# Altium schematic sheet EL_LCD_V2.0.SchDoc
size A1
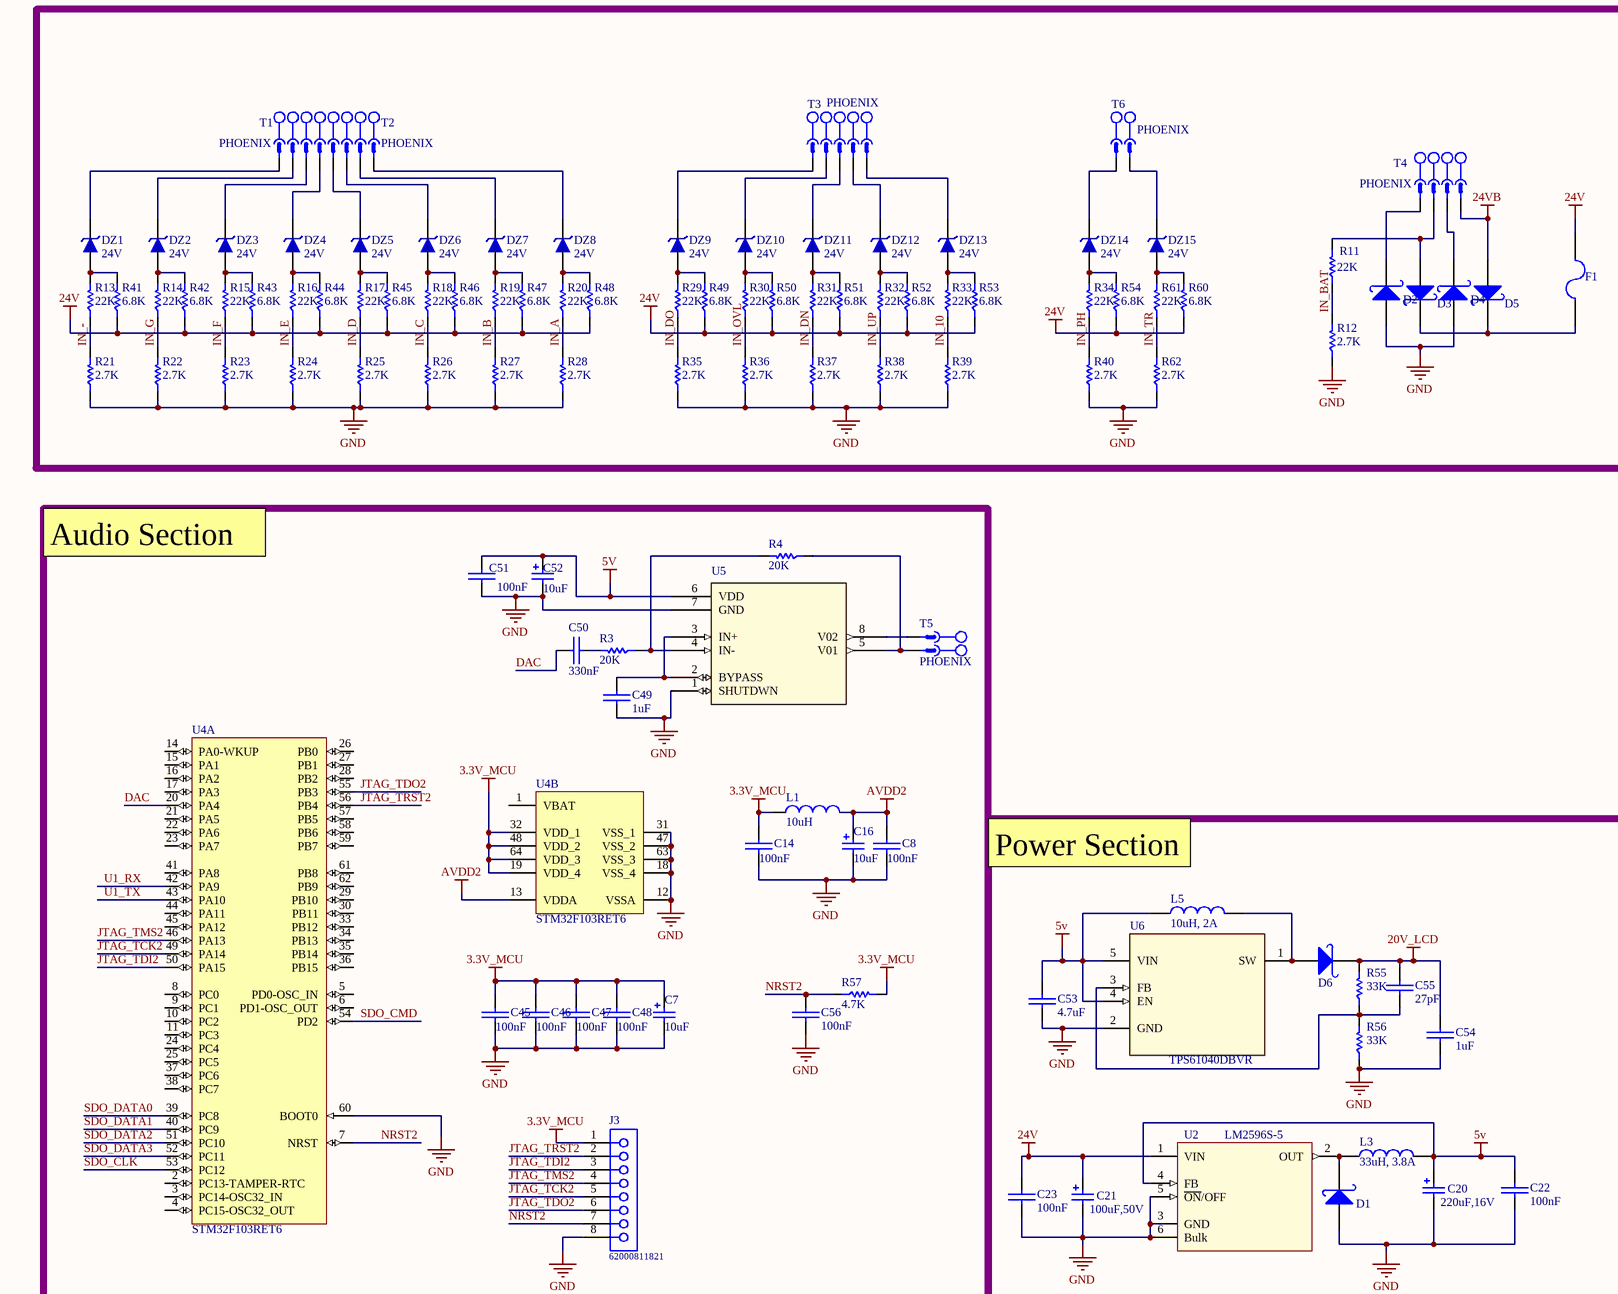
[diagram p0: EL_LCD_V2.0.SchDoc, top left]
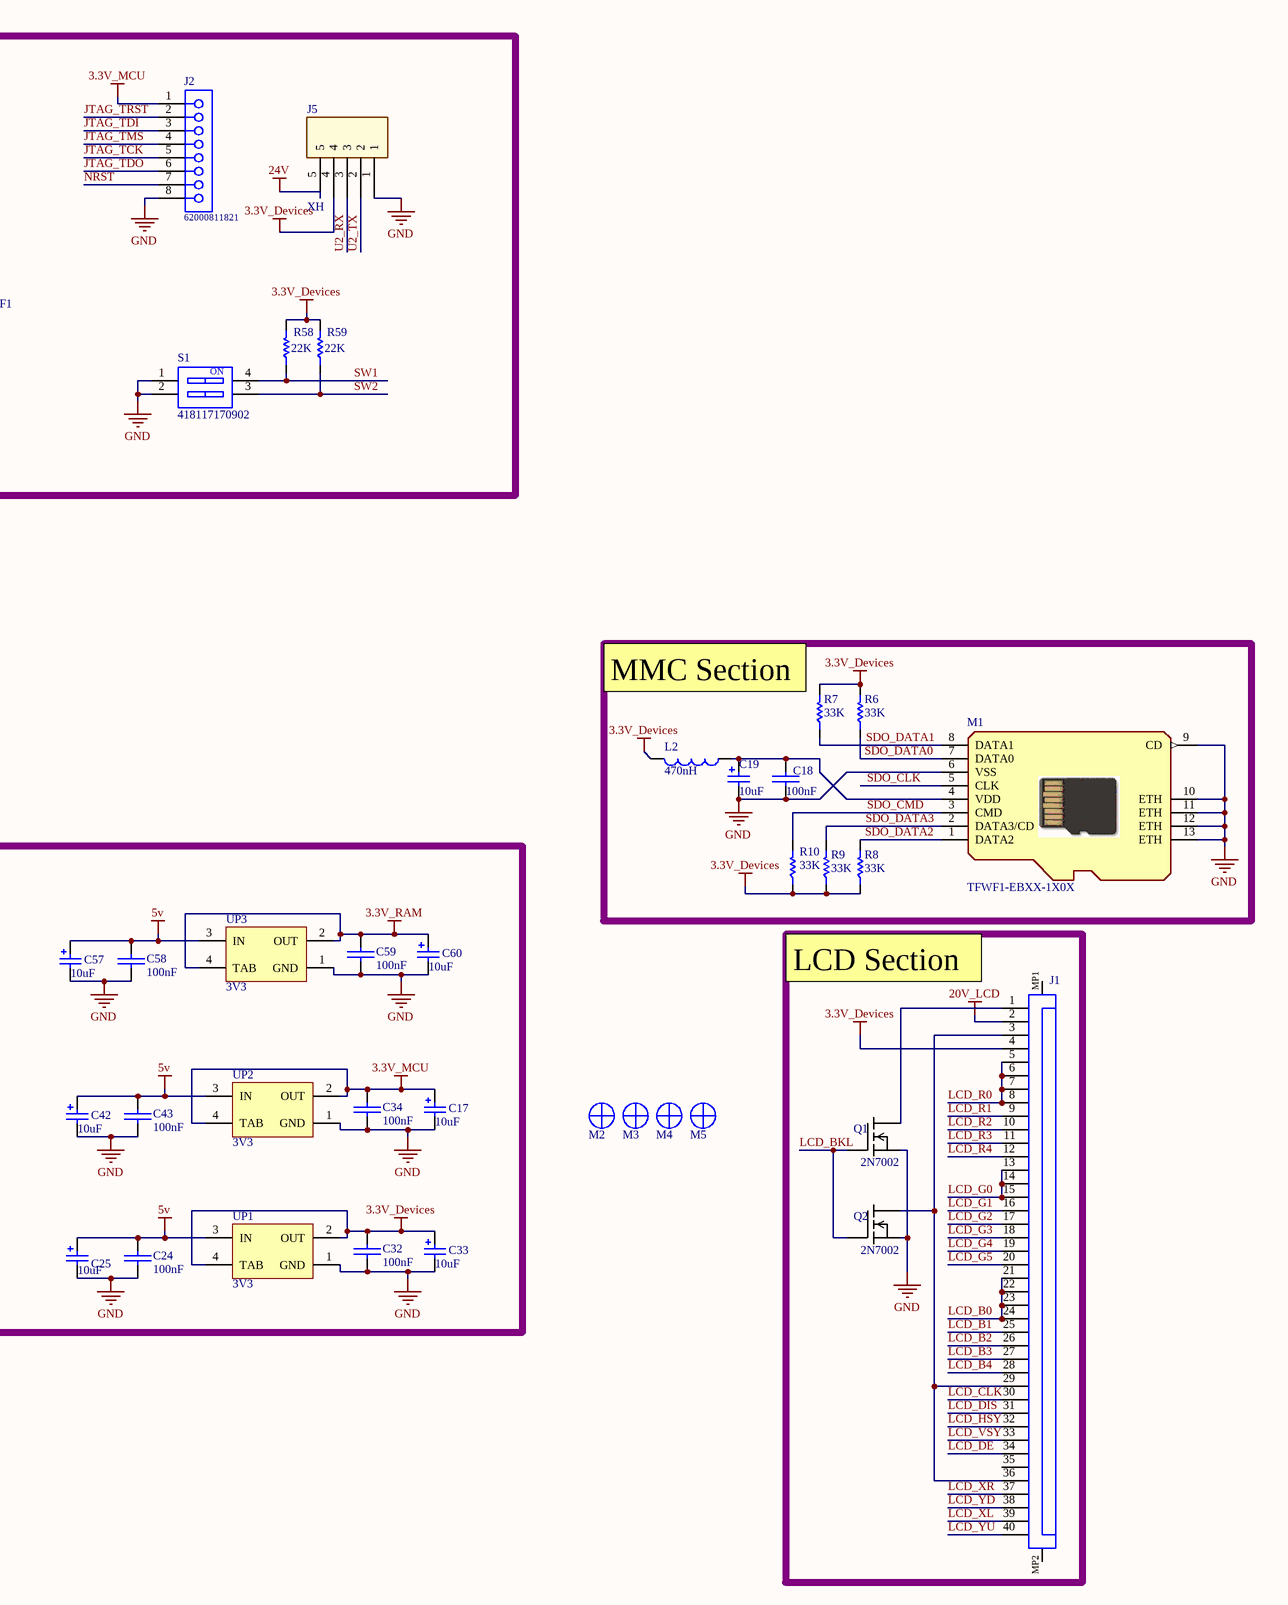
[diagram p1: EL_LCD_V2.0.SchDoc, top right]
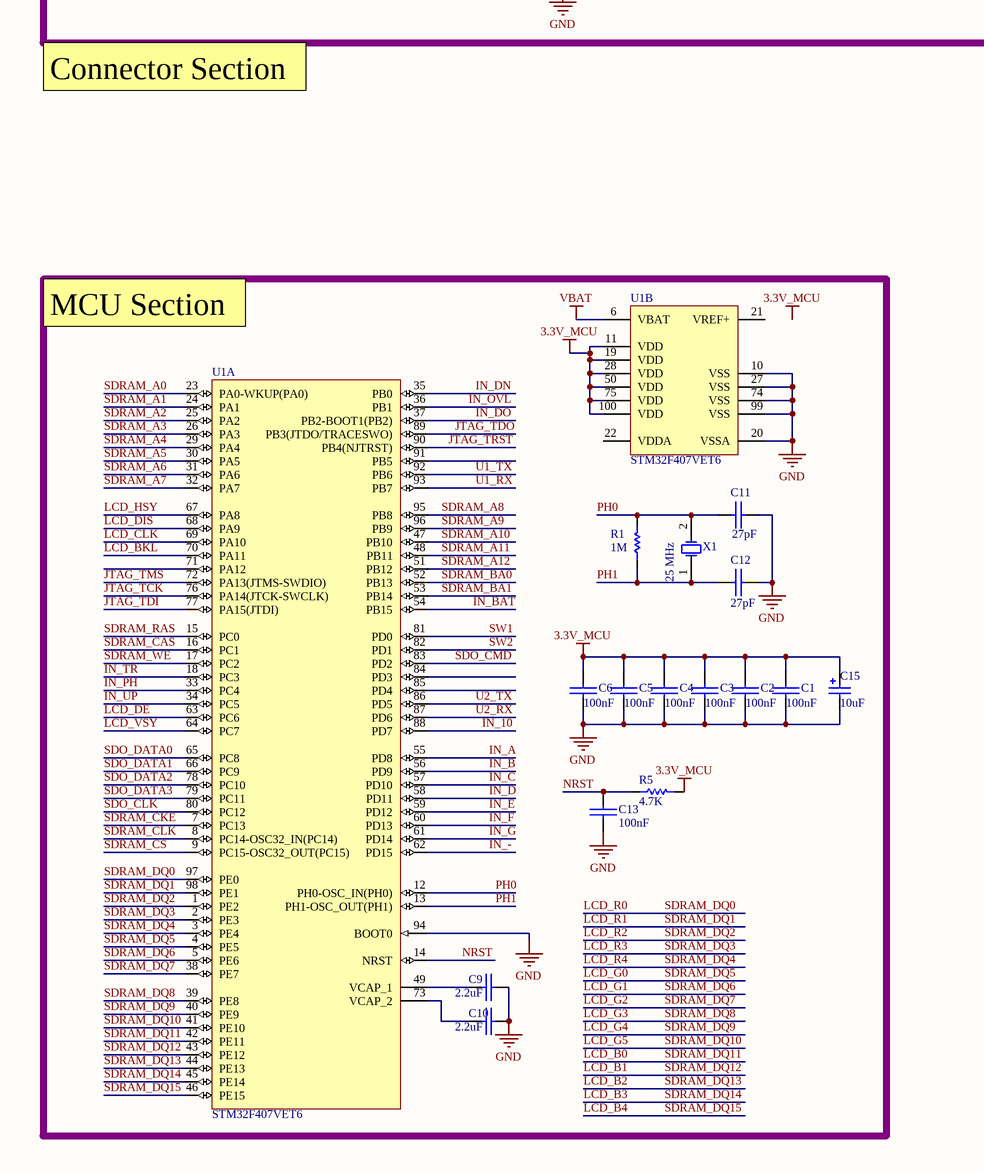
[diagram p2: EL_LCD_V2.0.SchDoc, bottom left]
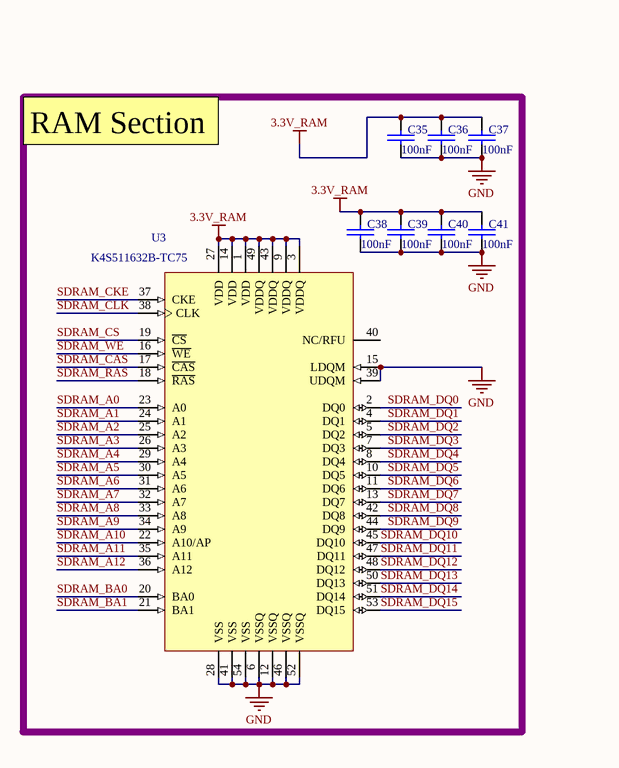
[diagram p3: EL_LCD_V2.0.SchDoc, bottom right]

## Parts
C1  100nF  [SMD_CAP_0805]
C2  100nF  [SMD_CAP_0805]
C3  100nF  [SMD_CAP_0805]
C4  100nF  [SMD_CAP_0805]
C5  100nF  [SMD_CAP_0805]
C6  100nF  [SMD_CAP_0805]
C7  10uF  [WCAP-AS5H_4x5.5]
C8  100nF  [SMD_CAP_0805]
C9  2.2uF  [SMD_CAP_1206]
C10  2.2uF  [SMD_CAP_1206]
C11  27pF  [SMD_CAP_0805]
C12  27pF  [SMD_CAP_0805]
C13  100nF  [SMD_CAP_0805]
C14  100nF  [SMD_CAP_0805]
C15  10uF  [WCAP-AS5H_4x5.5]
C16  10uF  [WCAP-AS5H_4x5.5]
C17  10uF  [WCAP-AS5H_4x5.5]
C18  100nF  [SMD_CAP_0805]
C19  10uF  [WCAP-AS5H_4x5.5]
C20  220uF,16V  [WCAP-AS5H_6.3x7.7]
C21  100uF,50V  [WCAP-AS5H_8x10.5]
C22  100nF  [SMD_CAP_0805]
C23  100nF  [SMD_CAP_0805]
C24  100nF  [SMD_CAP_0805]
C25  10uF  [WCAP-AS5H_4x5.5]
C32  100nF  [SMD_CAP_0805]
C33  10uF  [WCAP-AS5H_4x5.5]
C34  100nF  [SMD_CAP_0805]
C35  100nF  [SMD_CAP_0805]
C36  100nF  [SMD_CAP_0805]
C37  100nF  [SMD_CAP_0805]
C38  100nF  [SMD_CAP_0805]
C39  100nF  [SMD_CAP_0805]
C40  100nF  [SMD_CAP_0805]
C41  100nF  [SMD_CAP_0805]
C42  10uF  [WCAP-AS5H_4x5.5]
C43  100nF  [SMD_CAP_0805]
C45  100nF  [SMD_CAP_0805]
C46  100nF  [SMD_CAP_0805]
C47  100nF  [SMD_CAP_0805]
C48  100nF  [SMD_CAP_0805]
C49  1uF  [SMD_CAP_0805]
C50  330nF  [SMD_CAP_0805]
C51  100nF  [SMD_CAP_0805]
C52  10uF  [WCAP-AS5H_4x5.5]
C53  4.7uF  [SMD_CAP_0805]
C54  1uF  [SMD_CAP_1206]
C55  27pF  [SMD_CAP_0805]
C56  100nF  [SMD_CAP_0805]
C57  10uF  [WCAP-AS5H_4x5.5]
C58  100nF  [SMD_CAP_0805]
C59  100nF  [SMD_CAP_0805]
C60  10uF  [WCAP-AS5H_4x5.5]
D1  1n5822  [Diode 1N4007 SMD]  (value not drawn)
D2  1n5822  [Diode 1N4007 SMD]  (value not drawn)
D3  1n5822  [Diode 1N4007 SMD]  (value not drawn)
D4  1n5822  [Diode 1N4007 SMD]  (value not drawn)
D5  1n5822  [Diode 1N4007 SMD]  (value not drawn)
D6  1n5822  [Diode 1N4007 SMD]  (value not drawn)
DZ1  24V  [SOD80, LL-34]
DZ2  24V  [SOD80, LL-34]
DZ3  24V  [SOD80, LL-34]
DZ4  24V  [SOD80, LL-34]
DZ5  24V  [SOD80, LL-34]
DZ6  24V  [SOD80, LL-34]
DZ7  24V  [SOD80, LL-34]
DZ8  24V  [SOD80, LL-34]
DZ9  24V  [SOD80, LL-34]
DZ10  24V  [SOD80, LL-34]
DZ11  24V  [SOD80, LL-34]
DZ12  24V  [SOD80, LL-34]
DZ13  24V  [SOD80, LL-34]
DZ14  24V  [SOD80, LL-34]
DZ15  24V  [SOD80, LL-34]
F1  F=1.0 A  [1206 FUSE]  (value not drawn)
J1  (no value)  [687140149022]
J2  62000811821  [62000811821]
J3  62000811821  [62000811821]
J5  XH  [XH-12-Right]
L1  10uH  [IND1206]
L2  470nH  [IND1206]
L3  33uH, 3.8A  [WE-PD_1210]
L5  10uH, 2A  [WE-PD_7345]
M1  TFWF1-EBXX-1X0X  [TFWF1-EBXX-1X0X]
M2  Screw  [Board Screw]  (value not drawn)
M3  Screw  [Board Screw]  (value not drawn)
M4  Screw  [Board Screw]  (value not drawn)
M5  Screw  [Board Screw]  (value not drawn)
Q1  2N7002  [*SOT23]
Q2  2N7002  [*SOT23]
R1  1M  [RES 0805 (2012X06L)]
R3  20K  [RES 0805 (2012X06L)]
R4  20K  [RES 0805 (2012X06L)]
R5  4.7K  [RES 0805 (2012X06L)]
R6  33K  [RES 0805 (2012X06L)]
R7  33K  [RES 0805 (2012X06L)]
R8  33K  [RES 0805 (2012X06L)]
R9  33K  [RES 0805 (2012X06L)]
R10  33K  [RES 0805 (2012X06L)]
R11  22K  [RES 0805 (2012X06L)]
R12  2.7K  [RES 0805 (2012X06L)]
R13  22K  [RES 0805 (2012X06L)]
R14  22K  [RES 0805 (2012X06L)]
R15  22K  [RES 0805 (2012X06L)]
R16  22K  [RES 0805 (2012X06L)]
R17  22K  [RES 0805 (2012X06L)]
R18  22K  [RES 0805 (2012X06L)]
R19  22K  [RES 0805 (2012X06L)]
R20  22K  [RES 0805 (2012X06L)]
R21  2.7K  [RES 0805 (2012X06L)]
R22  2.7K  [RES 0805 (2012X06L)]
R23  2.7K  [RES 0805 (2012X06L)]
R24  2.7K  [RES 0805 (2012X06L)]
R25  2.7K  [RES 0805 (2012X06L)]
R26  2.7K  [RES 0805 (2012X06L)]
R27  2.7K  [RES 0805 (2012X06L)]
R28  2.7K  [RES 0805 (2012X06L)]
R29  22K  [RES 0805 (2012X06L)]
R30  22K  [RES 0805 (2012X06L)]
R31  22K  [RES 0805 (2012X06L)]
R32  22K  [RES 0805 (2012X06L)]
R33  22K  [RES 0805 (2012X06L)]
R34  22K  [RES 0805 (2012X06L)]
R35  2.7K  [RES 0805 (2012X06L)]
R36  2.7K  [RES 0805 (2012X06L)]
R37  2.7K  [RES 0805 (2012X06L)]
R38  2.7K  [RES 0805 (2012X06L)]
R39  2.7K  [RES 0805 (2012X06L)]
R40  2.7K  [RES 0805 (2012X06L)]
R41  6.8K  [RES 0805 (2012X06L)]
R42  6.8K  [RES 0805 (2012X06L)]
R43  6.8K  [RES 0805 (2012X06L)]
R44  6.8K  [RES 0805 (2012X06L)]
R45  6.8K  [RES 0805 (2012X06L)]
R46  6.8K  [RES 0805 (2012X06L)]
R47  6.8K  [RES 0805 (2012X06L)]
R48  6.8K  [RES 0805 (2012X06L)]
R49  6.8K  [RES 0805 (2012X06L)]
R50  6.8K  [RES 0805 (2012X06L)]
R51  6.8K  [RES 0805 (2012X06L)]
R52  6.8K  [RES 0805 (2012X06L)]
R53  6.8K  [RES 0805 (2012X06L)]
R54  6.8K  [RES 0805 (2012X06L)]
R55  33K  [RES 0805 (2012X06L)]
R56  33K  [RES 0805 (2012X06L)]
R57  4.7K  [RES 0805 (2012X06L)]
R58  22K  [RES 0805 (2012X06L)]
R59  22K  [RES 0805 (2012X06L)]
R60  6.8K  [RES 0805 (2012X06L)]
R61  22K  [RES 0805 (2012X06L)]
R62  2.7K  [RES 0805 (2012X06L)]
S1  418117170902  [418117170902]
T1  PHOENIX  [MSTB 2,5/4-G-5,08]
T2  PHOENIX  [MSTB 2,5/4-G-5,08]
T3  PHOENIX  [MSTB 2,5/5-G-5,08]
T4  PHOENIX  [MSTB 2,5/4-G-5,08]
T5  PHOENIX  [MSTB 2,5/2-G-5,08]
T6  PHOENIX  [MSTB 2,5/2-G-5,08]
U1  STM32F407VET6  [STM-LQFP100_N]  (parts A,B of 2)
U2  LM2596S-5  [*TO170P1435X465-6N]
U3  K4S511632B-TC75  [54_TSOP2_400AF_N]
U4  STM32F103RET6  [STM-LQFP64_N]  (parts A,B of 2)
U5  LM4871  [*SO08]  (value not drawn)
U6  TPS61040DBVR  [*SOT95P280X145-5N]
UP1  3V3  [SOT223]
UP2  3V3  [SOT223]
UP3  3V3  [SOT223]
X1  25 MHz  [Crystal SMD]

## Nets
3.3V_Devices: C32.1(+) C33.2(P) J1.4 J5.4 L2.2 R6.2 R7.2 R8.1 R9.1 R10.1 R58.2 R59.2 UP1.2(OUT) UP1.4(TAB)
3.3V_MCU: C1.1(+) C2.1(+) C3.1(+) C4.1(+) C5.1(+) C6.1(+) C7.2(P) C14.1(+) C15.2(P) C17.2(P) C34.1(+) C45.1(+) C46.1(+) C47.1(+) C48.1(+) J2.1 J3.1 L1.1 R5.2 R57.2 U1.11(VDD) U1.19(VDD) U1.28(VDD) U1.50(VDD) U1.75(VDD) U1.100(VDD) U4.19(VDD_4) U4.32(VDD_1) U4.48(VDD_2) U4.64(VDD_3) UP2.2(OUT) UP2.4(TAB)
3.3V_RAM: C35.1(+) C36.1(+) C37.1(+) C38.1(+) C39.1(+) C40.1(+) C41.1(+) C59.1(+) C60.2(P) U3.1(VDD) U3.3(VDDQ) U3.9(VDDQ) U3.14(VDD) U3.27(VDD) U3.43(VDDQ) U3.49(VDDQ) UP3.2(OUT) UP3.4(TAB)
5v: C20.2(P) C22.1(+) C24.1(+) C25.2(P) C42.2(P) C43.1(+) C51.1(+) C52.2(P) C53.1(+) C57.2(P) C58.1(+) L3.2 L5.1 U2.4(FB) U5.6(VDD) U6.4(EN) U6.5(VIN) UP1.3(IN) UP2.3(IN) UP3.3(IN)
20V_LCD: C54.1(+) C55.2(-) D6.2(K) J1.2 R55.2
24V: C21.2(P) C23.1(+) F1.2 J5.5 R41.1 R42.1 R43.1 R44.1 R45.1 R46.1 R47.1 R48.1 R49.1 R50.1 R51.1 R52.1 R53.1 R54.1 R60.1 U2.1(VIN)
24VB: D5.1(A) T4.4
AVDD2: C8.1(+) C16.2(P) L1.2 U4.13(VDDA)
GND: C1.2(-) C2.2(-) C3.2(-) C4.2(-) C5.2(-) C6.2(-) C7.1(N) C8.2(-) C9.2(-) C10.2(-) C11.2(-) C12.2(-) C13.2(-) C14.2(-) C15.1(N) C16.1(N) C17.1(N) C18.2(-) C19.1(N) C20.1(N) C21.1(N) C22.2(-) C23.2(-) C24.2(-) C25.1(N) C32.2(-) C33.1(N) C34.2(-) C35.2(-) C36.2(-) C37.2(-) C38.2(-) C39.2(-) C40.2(-) C41.2(-) C42.1(N) C43.2(-) C45.2(-) C46.2(-) C47.2(-) C48.2(-) C49.2(-) C51.2(-) C52.1(N) C53.2(-) C54.2(-) C56.2(-) C57.1(N) C58.2(-) C59.2(-) C60.1(N) D1.1(A) D2.1(A) D4.1(A) J2.8 J3.8 J5.1 M1.6(VSS) M1.9(CD) M1.10(ETH) M1.11(ETH) M1.12(ETH) M1.13(ETH) Q1.2(S) Q2.2(S) R12.1 R21.1 R22.1 R23.1 R24.1 R25.1 R26.1 R27.1 R28.1 R35.1 R36.1 R37.1 R38.1 R39.1 R40.1 R56.1 R62.1 S1.1 S1.2 U1.10(VSS) U1.20(VSSA) U1.27(VSS) U1.74(VSS) U1.94(BOOT0) U1.99(VSS) U2.3(GND) U2.5(~{ON}/OFF) U2.6(Bulk) U3.6(VSSQ) U3.12(VSSQ) U3.15(LDQM) U3.28(VSS) U3.39(UDQM) U3.41(VSS) U3.46(VSSQ) U3.52(VSSQ) U3.54(VSS) U4.12(VSSA) U4.18(VSS_4) U4.31(VSS_1) U4.47(VSS_2) U4.60(BOOT0) U4.63(VSS_3) U5.1(SHUTDWN) U5.7(GND) U6.2(GND) UP1.1(GND) UP2.1(GND) UP3.1(GND)
VBAT: U1.6(VBAT)
DAC: C50.1(+) U4.20(PA4)
IN_10: R33.1 R39.2 U1.88(PD7)
IN_-: R13.1 R21.2 U1.62(PD15)
IN_A: R20.1 R28.2 U1.55(PD8)
IN_B: R19.1 R27.2 U1.56(PD9)
IN_BAT: R11.1 R12.2 U1.54(PB15)
IN_C: R18.1 R26.2 U1.57(PD10)
IN_D: R17.1 R25.2 U1.58(PD11)
IN_DN: R31.1 R37.2 U1.35(PB0)
IN_DO: R29.1 R35.2 U1.37(PB2-BOOT1(PB2))
IN_E: R16.1 R24.2 U1.59(PD12)
IN_F: R15.1 R23.2 U1.60(PD13)
IN_G: R14.1 R22.2 U1.61(PD14)
IN_OVL: R30.1 R36.2 U1.36(PB1)
IN_PH: R34.1 R40.2 U1.33(PC4)
IN_TR: R61.1 R62.2 U1.18(PC3)
IN_UP: R32.1 R38.2 U1.34(PC5)
JTAG_TCK: J2.5 U1.76(PA14(JTCK-SWCLK))
JTAG_TCK2: J3.5 U4.49(PA14)
JTAG_TDI: J2.3 U1.77(PA15(JTDI))
JTAG_TDI2: J3.3 U4.50(PA15)
JTAG_TDO: J2.6 U1.89(PB3(JTDO/TRACESWO))
JTAG_TDO2: J3.6 U4.55(PB3)
JTAG_TMS: J2.4 U1.72(PA13(JTMS-SWDIO))
JTAG_TMS2: J3.4 U4.46(PA13)
JTAG_TRST: J2.2 U1.90(PB4(NJTRST))
JTAG_TRST2: J3.2 U4.56(PB4)
LCD_B0: J1.21 J1.22 J1.23 J1.24 U1.42(PE11) U3.47(DQ11)  [also labelled SDRAM_DQ11]
LCD_B1: J1.25 U1.43(PE12) U3.48(DQ12)  [also labelled SDRAM_DQ12]
LCD_B2: J1.26 U1.44(PE13) U3.50(DQ13)  [also labelled SDRAM_DQ13]
LCD_B3: J1.27 U1.45(PE14) U3.51(DQ14)  [also labelled SDRAM_DQ14]
LCD_B4: J1.28 U1.46(PE15) U3.53(DQ15)  [also labelled SDRAM_DQ15]
LCD_BKL: Q1.1(G) Q2.1(G) U1.70(PA11)
LCD_CLK: J1.30 U1.69(PA10)
LCD_DE: J1.34 U1.63(PC6)
LCD_DIS: J1.31 U1.68(PA9)
LCD_G0: J1.13 J1.14 J1.15 U1.4(PE5) U3.10(DQ5)  [also labelled SDRAM_DQ5]
LCD_G1: J1.16 U1.5(PE6) U3.11(DQ6)  [also labelled SDRAM_DQ6]
LCD_G2: J1.17 U1.38(PE7) U3.13(DQ7)  [also labelled SDRAM_DQ7]
LCD_G3: J1.18 U1.39(PE8) U3.42(DQ8)  [also labelled SDRAM_DQ8]
LCD_G4: J1.19 U1.40(PE9) U3.44(DQ9)  [also labelled SDRAM_DQ9]
LCD_G5: J1.20 U1.41(PE10) U3.45(DQ10)  [also labelled SDRAM_DQ10]
LCD_HSY: J1.32 U1.67(PA8)
LCD_R0: J1.5 J1.6 J1.7 J1.8 U1.97(PE0) U3.2(DQ0)  [also labelled SDRAM_DQ0]
LCD_R1: J1.9 U1.98(PE1) U3.4(DQ1)  [also labelled SDRAM_DQ1]
LCD_R2: J1.10 U1.1(PE2) U3.5(DQ2)  [also labelled SDRAM_DQ2]
LCD_R3: J1.11 U1.2(PE3) U3.7(DQ3)  [also labelled SDRAM_DQ3]
LCD_R4: J1.12 U1.3(PE4) U3.8(DQ4)  [also labelled SDRAM_DQ4]
LCD_VSY: J1.33 U1.64(PC7)
LCD_XL: J1.39
LCD_XR: J1.37
LCD_YD: J1.38
LCD_YU: J1.40
NRST: C13.1(+) J2.7 R5.1 U1.14(NRST)
NRST2: C56.1(+) J3.7 R57.1 U4.7(NRST)
PH0: C11.1(+) R1.2 U1.12(PH0-OSC_IN(PH0)) X1.2(OSC2)
PH1: C12.1(+) R1.1 U1.13(PH1-OSC_OUT(PH1)) X1.1(OSC1)
SDO_CLK: M1.5(CLK) U1.80(PC12) U4.53(PC12)
SDO_CMD: M1.3(CMD) R10.2 U1.83(PD2) U4.54(PD2)
SDO_DATA0: M1.7(DATA0) R6.1 U1.65(PC8) U4.39(PC8)
SDO_DATA1: M1.8(DATA1) R7.1 U1.66(PC9) U4.40(PC9)
SDO_DATA2: M1.1(DATA2) R8.2 U1.78(PC10) U4.51(PC10)
SDO_DATA3: M1.2(DATA3/CD) R9.2 U1.79(PC11) U4.52(PC11)
SDRAM_A0: U1.23(PA0-WKUP(PA0)) U3.23(A0)
SDRAM_A1: U1.24(PA1) U3.24(A1)
SDRAM_A2: U1.25(PA2) U3.25(A2)
SDRAM_A3: U1.26(PA3) U3.26(A3)
SDRAM_A4: U1.29(PA4) U3.29(A4)
SDRAM_A5: U1.30(PA5) U3.30(A5)
SDRAM_A6: U1.31(PA6) U3.31(A6)
SDRAM_A7: U1.32(PA7) U3.32(A7)
SDRAM_A8: U1.95(PB8) U3.33(A8)
SDRAM_A9: U1.96(PB9) U3.34(A9)
SDRAM_A10: U1.47(PB10) U3.22(A10/AP)
SDRAM_A11: U1.48(PB11) U3.35(A11)
SDRAM_A12: U1.51(PB12) U3.36(A12)
SDRAM_BA0: U1.52(PB13) U3.20(BA0)
SDRAM_BA1: U1.53(PB14) U3.21(BA1)
SDRAM_CAS: U1.16(PC1) U3.17(~{CAS})
SDRAM_CKE: U1.7(PC13) U3.37(CKE)
SDRAM_CLK: U1.8(PC14-OSC32_IN(PC14)) U3.38(CLK)
SDRAM_CS: U1.9(PC15-OSC32_OUT(PC15)) U3.19(~{CS})
SDRAM_RAS: U1.15(PC0) U3.18(~{RAS})
SDRAM_WE: U1.17(PC2) U3.16(~{WE})
SW1: R58.1 S1.4 U1.81(PD0)
SW2: R59.1 S1.3 U1.82(PD1)
U1_RX: U1.93(PB7) U4.42(PA9)
U1_TX: U1.92(PB6) U4.43(PA10)
U2_RX: J5.3 U1.87(PD6)
U2_TX: J5.2 U1.86(PD5)
NetC9_1: C9.1(+) U1.49(VCAP_1)
NetC10_1: C10.1(+) U1.73(VCAP_2)
NetC18_1: C18.1(+) C19.2(P) L2.1 M1.4(VDD)
NetC49_1: C49.1(+) U5.2(BYPASS) U5.3(IN+)
NetC50_2: C50.2(-) R3.2
NetC55_1: C55.1(+) R55.1 R56.2 U6.3(FB)
NetD1_2: D1.2(K) L3.1 U2.2(OUT)
NetD2_2: D2.2(K) T4.1
NetD3_1: D3.1(A) R11.2 T4.2
NetD3_2: D3.2(K) D5.2(K) F1.1
NetD4_2: D4.2(K) T4.3
NetD6_1: D6.1(A) L5.2 U6.1(SW)
NetDZ1_1: DZ1.1 R13.2 R41.2
NetDZ1_2: DZ1.2 T1.1
NetDZ2_1: DZ2.1 R14.2 R42.2
NetDZ2_2: DZ2.2 T1.2
NetDZ3_1: DZ3.1 R15.2 R43.2
NetDZ3_2: DZ3.2 T1.3
NetDZ4_1: DZ4.1 R16.2 R44.2
NetDZ4_2: DZ4.2 T1.4
NetDZ5_1: DZ5.1 R17.2 R45.2
NetDZ5_2: DZ5.2 T2.1
NetDZ6_1: DZ6.1 R18.2 R46.2
NetDZ6_2: DZ6.2 T2.2
NetDZ7_1: DZ7.1 R19.2 R47.2
NetDZ7_2: DZ7.2 T2.3
NetDZ8_1: DZ8.1 R20.2 R48.2
NetDZ8_2: DZ8.2 T2.4
NetDZ9_1: DZ9.1 R29.2 R49.2
NetDZ9_2: DZ9.2 T3.1
NetDZ10_1: DZ10.1 R30.2 R50.2
NetDZ10_2: DZ10.2 T3.2
NetDZ11_1: DZ11.1 R31.2 R51.2
NetDZ11_2: DZ11.2 T3.3
NetDZ12_1: DZ12.1 R32.2 R52.2
NetDZ12_2: DZ12.2 T3.4
NetDZ13_1: DZ13.1 R33.2 R53.2
NetDZ13_2: DZ13.2 T3.5
NetDZ14_1: DZ14.1 R34.2 R54.2
NetDZ14_2: DZ14.2 T6.1
NetDZ15_1: DZ15.1 R60.2 R61.2
NetDZ15_2: DZ15.2 T6.2
NetJ1_1: J1.1 Q1.3(D)
NetJ1_3: J1.3 J1.29 J1.36 Q2.3(D)
NetR3_1: R3.1 R4.2 U5.4(IN-)
NetR4_1: R4.1 T5.2 U5.5(V01)
NetT5_1: T5.1 U5.8(V02)

Not connected (* = marked no-connect by the designer): J1 35 MP1 MP2; U1 21(VREF+) 22(VDDA) 71(PA12) 84(PD3) 85(PD4) 91(PB5); U3 40(NC/RFU); U4 1(VBAT) 2(PC13-TAMPER-RTC) 3(PC14-OSC32_IN) 4(PC15-OSC32_OUT) 5(PD0-OSC_IN) 6(PD1-OSC_OUT) 8(PC0) 9(PC1) 10(PC2) 11(PC3) 14(PA0-WKUP) 15(PA1) 16(PA2) 17(PA3) 21(PA5) 22(PA6) 23(PA7) 24(PC4) 25(PC5) 26(PB0) 27(PB1) 28(PB2) 29(PB10) 30(PB11) 33(PB12) 34(PB13) 35(PB14) 36(PB15) 37(PC6) 38(PC7) 41(PA8) 44(PA11) 45(PA12) 57(PB5) 58(PB6) 59(PB7) 61(PB8) 62(PB9)

## Notes on the sheet
- Audio Section
- (near R7) MMC Section
- (near L5) Power Section
- LCD Section
- Connector Section
- MCU Section
- RAM Section
- Labels drawn without touching a wire or pin: 3.3V_MCU
- (in symbol 418117170902) ON
- (in symbol TFWF1-EBXX-1X0X) Card Bottom View

## Library data of the parts
C1-C6 C8-C14 C18 C22-C24 C32 C34-C41 C43 C45-C51 C53-C56 C58 C59 = Cap-Bipolar: Bipolar Capacitor; Voltage: 100V; Designer: Saeid Jorablo; Organazation: ControTec; Adding Date: 1387/12/20
  C1-C6 C8 C13 C14 C18 C22-C24 C32 C34-C41 C43 C45-C48 C51 C56 C58 C59: Value: 100nF
  C9 C10: Value: 2.2uF
  C11 C12 C55: Value: 27pF
  C49 C54: Value: 1uF
  C50: Value: 330nF
  C53: Value: 4.7uF
C7 C15-C17 C19 C25 C33 C42 C52 C57 C60 = 865230140001: WCAP-AS5H SMT Aluminum Electrolytic Capacitors, D4mm x L5.5mm, 22uF, +/-20%, 6.3VDC; Dissipation Factor: 32%; Endurance: 5000h; Leakage Current: 3uA; Ripple Current max.: 22mA; Technical Reference: ASDB055220M6R3DVCTAE000; ComponentLink1Description: Manufacturer; ComponentLink1URL: http://www.we-online.de; ComponentLink2Description: Datasheet; ComponentLink2URL: https://katalog.we-online.com/pbs/datasheet/865230140001.pdf; Length: 5.5mm; Mounting Technology: SMT; Operating Temperature: -40 to +105degC; Packaging: Tape and Reel; Published Date: August 2019; Capacitance: 22uF; Diameter: 4mm; Part Number: 865230140001; Publisher: Wurth Elektronik; Capacitance Tolerance: +/-20%; Rated Voltage: 6.3VDC
C20 = 865230345005: WCAP-AS5H SMT Aluminum Electrolytic Capacitors, D6.3mm x L7.7mm, 100uF, +/-20%, 16VDC; Dissipation Factor: 22%; Endurance: 5000h; Leakage Current: 16uA; Ripple Current max.: 81mA; Technical Reference: ASDD077101M016DVCTCE000; ComponentLink1Description: Manufacturer; ComponentLink1URL: http://www.we-online.de; ComponentLink2Description: Datasheet; ComponentLink2URL: https://katalog.we-online.com/pbs/datasheet/865230345005.pdf; Length: 7.7mm; Mounting Technology: SMT; Operating Temperature: -40 to +105degC; Packaging: Tape and Reel; Published Date: August 2019; Capacitance: 100uF; Diameter: 6.3mm; Part Number: 865230345005; Publisher: Wurth Elektronik; Capacitance Tolerance: +/-20%; Rated Voltage: 16VDC
C21 = 865230653012: WCAP-AS5H SMT Aluminum Electrolytic Capacitors, D8mm x L10.5mm, 47uF, +/-20%, 50VDC; Dissipation Factor: 12%; Endurance: 5000h; Leakage Current: 23.5uA; Ripple Current max.: 95mA; Technical Reference: ASDE105470M050DVCTEE000; ComponentLink1Description: Manufacturer; ComponentLink1URL: http://www.we-online.de; ComponentLink2Description: Datasheet; ComponentLink2URL: https://katalog.we-online.com/pbs/datasheet/865230653012.pdf; Length: 10.5mm; Mounting Technology: SMT; Operating Temperature: -40 to +105degC; Packaging: Tape and Reel; Published Date: August 2019; Capacitance: 47uF; Diameter: 8mm; Part Number: 865230653012; Publisher: Wurth Elektronik; Capacitance Tolerance: +/-20%; Rated Voltage: 50VDC
D1-D6 = 1N5822 SMD: Schottky Rectifiers; Part. No: SS34; Manufacturer: ON Semiconductor/Fairchild; Designer: Abbas Basereh; Link: https://www.aliexpress.com/item/Free-shipping-100pcs-1n5822-sma-smd-do-214ac-Schottky-diode-ss34/32337482329.html?spm=2114.01010208.3.1.zLZDsP&ws_ab_test=searchweb0_0,searchweb201602_4_10065_10068_10084_10083_10080_10082_10081_10060_10061_10062_10056_10055_10054_10059_10099_10078_10079_427_10073_10103_10102_10096_10052_10050_10051,searchweb201603_4&btsid=6e50dc92-ac69-45bc-a19e-209af19ce602; Link: http://www.tme.eu/en/details/ss34/smd-schottky-diodes/vishay/ss34-e357t/; Link: http://www.digikey.com/product-detail/en/on-semiconductor-fairchild/SS34/SS34FSCT-ND/2094459; Data: 16-12-2016
DZ1-DZ15 = ZENER GENERAL DIODE: DIODE ZENER GENERAL; Published: 2017-1-12; PackageVersion: 2017-1-12; PackageReference: DO 35; Publisher: Abbas Basereh; PackageDescription: DIODE GEN ZENER; ComponentLink1Description: Manufacturer Link; ComponentLink2Description: Datasheet; VALUE: 24V
F1 = Fuse SMD1206: SMD Fuses 1206; Designer: Abbas Basereh; Desc.: SMD Fuses 1206; Data: 16-12-2016
J1 = 687140149022: SMT ZIF Connectors Hinge Type WR-FPC, Horizontal, Bottom Contact, pitch 0.5 mm, 40 pins; Rated Current: 0.5 A; Contact Resistance: 50 mOhm; Withstanding Voltage: 150 VAC; Working Voltage: 50 VAC; Pin Number: 40; Pitch: 0.5 mm; ComponentLink1Description: Manufacturer; ComponentLink1URL: http://www.we-online.de; ComponentLink2Description: Datasheet; ComponentLink2URL: https://katalog.we-online.de/em/datasheet/687140149022.pdf; Part Number: 687140149022; Published Date: August 2018; Publisher: Wurth Elektronik; Operating Temperature: -40 to 105 degC; Packaging: Tape and Reel; Mounting Technology: SMT; Orientation: Horizontal; Contact Design: Bottom Contact
J2 J3 = 62000811821: WR-PHD Socket Header, THT, pitch 2mm, Single Row, Vertical, 8pin; Pin Number: 8; Gender: Female; Rated Current: 2A; Working Voltage: 250VAC; Withstanding Voltage: 500VAC; Contact Resistance: 20mOhm; ComponentLink1Description: Manufacturer; ComponentLink1URL: http://www.we-online.de; ComponentLink2Description: Datasheet; ComponentLink2URL: https://katalog.we-online.de/em/datasheet/62000811821.pdf; Part Number: 62000811821; Published Date: June 2019; Publisher: Wurth Elektronik; Pitch: 2mm; Operating Temperature: -40 to +105degC; Mounting Technology: THT; Packaging: Tube; Row Number: Single; Orientation: Vertical
J5 = XH-Connector-4pin-right
L1 L2 = INDUCTOR SMD PACKAGE: TOTAL INDUCTOR SMD PACK; Designer: Abbas Basereh; Desc.: INDUCTOR  SMD TOTAL PACKAGES; Data: 2017-3-10
  L1: VALUE: 10uH
  L2: VALUE: 470nH
L3 = 7447709470: WE-PD SMT Power Inductor, size 1210, 47uH, 3.8A; DC Resistance max.: 60mOhm; Self Resonant Frequency: 6.5MHz; Saturation Current: 4.5A; ComponentLink1Description: Manufacturer; ComponentLink1URL: http://www.we-online.de; ComponentLink2Description: Datasheet; ComponentLink2URL: https://katalog.we-online.com/pbs/datasheet/7447709470.pdf; Part Number: 7447709470; Published Date: April 2019; Publisher: Wurth Elektronik; Rated Current: 3.8A; Size: 1210; Inductance: 47uH; Operating Temperature: -40 to +125degC; Mounting Technology: SMT; Packaging: Tape and Reel; Value: 33uH, 3.8A
L5 = 74477710: WE-PD SMT Power Inductor, size 7345, 10uH, 2A; DC Resistance max.: 49mOhm; Self Resonant Frequency: 26MHz; Saturation Current: 2.6A; ComponentLink1Description: Manufacturer; ComponentLink1URL: http://www.we-online.de; ComponentLink2Description: Datasheet; ComponentLink2URL: https://katalog.we-online.com/pbs/datasheet/74477710.pdf; Part Number: 74477710; Published Date: April 2019; Publisher: Wurth Elektronik; Rated Current: 2A; Size: 7345; Inductance: 10uH; Operating Temperature: -40 to +125degC; Mounting Technology: SMT; Packaging: Tape and Reel
M1 = TFWF1-EBXX-1X0X: T-Flash 8pin SMT; Manufacturer: Wellco T&C Co., Ltd.; Link to Datasheet: *; Link to Picture: *; Operating Temp: *; Rating: *; Stability Frequency: *; Storage Temp: *; Tolerance: *; ComponentLink1Description: *; ComponentLink1URL: *; Manufacture Part #: TFWF1-EBXX-1X0X; Value: TFWF1-EBXX-1X0X
M2-M5 = Board Screw 3MM: Board Screw With Spacer
Q1 Q2 = 2N7002: Transistor NPN Mos 2N7002 SILICONIX miliampere=100 V=60 SOt23; MF: STMicroelectronics; Availability: Unavailable; SnapEDA_Link: https://www.snapeda.com/parts/2N7002/STMicroelectronics/view-part/?ref=snap; Price: None; Package: SOT-23-3 Vishay; MP: 2N7002; Value: *
R1 R3-R62 = Resistor: Tolerance: 5%; Power: 1/8 W
  R1: Value: 1M
  R3 R4: Value: 20K
  R5 R57: Value: 4.7K
  R6-R10 R55 R56: Value: 33K
  R11 R13-R20 R29-R34 R58 R59 R61: Value: 22K
  R12 R21-R28 R35-R40 R62: Value: 2.7K
  R41-R54 R60: Value: 6.8K
S1 = 418117170902: WS-DITV Compact THT Dip Switch, Flat Actuator, pitch 2.54mm, 2p; Operation Force: 800g; Pole Number: 2; Actuator Type: Flat Type; Circuit: SPST-NO; Rated Current Switching: 25mA; Rated Current Non-Switching: 100mA; Rated Voltage Non-Switching: 50VDC; Rated Voltage Switching: 24VDC; ComponentLink1Description: Manufacturer; ComponentLink1URL: http://www.we-online.de; ComponentLink2Description: Datasheet; ComponentLink2URL: https://katalog.we-online.com/em/datasheet/418117170902.pdf; Pitch: 2.54mm; Contact Material: Copper Alloy; Mounting Technology: THT; Operating Temperature: -40 to +85degC; Contact Plating: Gold; Packaging: Tube; Part Number: 418117170902; Publisher: Wurth Elektronik; Published Date: September 2019
T1 T2 T4 = CON_Phoenix_MSTB_04: 4 Pitch: 5.08 mm Color: green Contact surface: Tin Assembly; Manufacturer: PHOENIX CONTACT; Connector type: PCB Terminal Block; designer: ABBAS BASEREH; Max Current: 12 A; Positions: 4; Voltage: 320 V; Category: Connector; ComponentLink1Description: Header, Nominal current: 12 A Rated voltage (III/2): 320 V Number of positions: 4 Pitch: 5.08 mm Color: green Contact surface: Tin Assembly: Soldering  DESIGNER:ABBAS BASEREH; ComponentLink2Description: Reference; Mounting Technology: Through-Hole; Pin Count: 4; Revision 1: 2017-3-1; Status: Unreleased; PART.NO: PHOENIX
T3 = CON_Phoenix_MSTB_05: 5 Pitch: 5.08 mm Color: green Contact surface: Tin Assembly; Manufacturer: PHOENIX CONTACT; Connector type: PCB Terminal Block; designer: ABBAS BASEREH; Max Current: 12 A; Positions: 5; Voltage: 320 V; Category: Connector; ComponentLink1Description: Header, Nominal current: 12 A Rated voltage (III/2): 320 V Number of positions: 5 Pitch: 5.08 mm Color: green Contact surface: Tin Assembly: Soldering  DESIGNER:ABBAS BASEREH; ComponentLink2Description: Reference; Mounting Technology: Through-Hole; Pin Count: 5; Revision 1: 2017-3-1; Status: Unreleased; PART.NO: PHOENIX
T5 T6 = CON_Phoenix_MSTB_02: 2 Pitch: 5.08 mm Color: green Contact surface: Tin Assembly; Manufacturer: PHOENIX CONTACT; Connector type: PCB Terminal Block; designer: ABBAS BASEREH; Max Current: 12 A; Positions: 2; Voltage: 320 V; Category: Connector; ComponentLink1Description: Header, Nominal current: 12 A Rated voltage (III/2): 320 V Number of positions: 2 Pitch: 5.08 mm Color: green Contact surface: Tin Assembly: Soldering  DESIGNER:ABBAS BASEREH; ComponentLink2Description: Reference; Mounting Technology: Through-Hole; Pin Count: 2; Revision 1: 2017-3-1; Status: Unreleased; PART.NO: PHOENIX
U1 = STM32F407VET6: ARM Cortex-M4 32-bit MCU+FPU, 210 DMIPS, 512 kB Flash, 192 kB Internal RAM, 82 I/Os, 100-pin LQFP, -40 to 85 degC, Tray; Manufacturer: STMicroelectronics; D/A Converter: 2x12-bit; FLASH Size (Prog) (kB): 512; I/Os (High Current): 82; Internal RAM Size (kB): 192; Operating Frequency(F) (Processor speed) (MHz): 168; Supply Voltage(Vcc) max (V): 3.6; Supply Voltage(Vcc) min (V): 1.8; DatasheetVersion: Rev. 4; PackageVersion: Rev. 1, 06/2013; PackageReference: LQFP100; PackageDescription: 100-Pin Low Profile Quad Flat Package, 14 x 14 mm Body, 0.5 mm Pitch; Supplier 1: Digi-Key; Supplier Part Number 1: 497-12075-ND; Supplier 2: Farnell; Supplier Part Number 2: 2064367; Supplier 3: Newark; Supplier Part Number 3: 73T2332; Supplier 4: Mouser; Supplier Part Number 4: 511-STM32F407VET6; Core: ARM Cortex-M4; Packing: Tray; Mounting Technology: Surface Mount; PartNumber: STM32F407VET6; ComponentLink1Description: Manufacturer URL; ComponentLink1URL: http://www.st.com/web/en/home.html; ComponentLink2Description: Datasheet; ComponentLink2URL: http://www.st.com/st-web-ui/static/active/en/resource/technical/document/datasheet/DM00037051.pdf; ComponentLink3Description: Package Specification; ComponentLink3URL: http://www.st.com/st-web-ui/static/active/en/resource/technical/document/data_brief/DM00071938.pdf
U2 = LM2596S-3.3: MF: Texas Instruments; SnapEDA_Link: https://www.snapeda.com/parts/LM2596S-3.3/Texas%20Instruments/view-part/?ref=snap; Availability: Unavailable; MP: LM2596S-5; Price: None; Package: TO-263-6 HTC Korea; Value: *
U3 = K4S511632B-TC75: 512Mb Synchronous High Data Rate DRAM, 8Mb x 16Bit x 4 Banks, 54-Pin TSOP; Frequency: 133MHz (max); RowAddress: A0-A12; ColumnAddress: A0-A9; Published: 11-Oct-2004; LatestRevisionDate: 13-Apr-2006; LatestRevisionNote: IPC-7351 Footprint Added.; DatasheetVersion: rev1.1, Feb-2004; PackageVersion: Aug-2004; PackageReference: 54_TSOP2_400AF; Publisher: Altium Limited; PackageDescription: 54-Pin Small Outline Package 0.8 mm Pitch; ComponentLink1Description: Manufacturer Link; ComponentLink1URL: http://www.samsung.com; ComponentLink2Description: Datasheet; ComponentLink2URL: http://www.samsung.com/Products/Semiconductor/DRAM/SDRAM/SDRAMcomponent/512Mbit/K4S510432B/ds_sdr_512mb_b-die_x4x8x16_11.pdf
U4 = STM32F103RET6: ARM Cortex-M3 32-bit MCU, 512 KB Flash, 64 KB Internal RAM, 51 I/Os, 64-pin LQFP, -40 to 85 degC, Tray; A/D Converter: 3x12-bit (16 Channel); D/A Converter: 2x12-bit (2 Channel); FLASH Size (Prog) (kB): 512; I/Os (High Current): 51; Internal RAM Size (kB): 64; Operating Frequency(F) (Processor speed) (MHz): 72; Supply Voltage(Vcc) min (V): 2; DatasheetVersion: Rev. 8; PackageVersion: Rev. 4, 06/2013; PackageReference: LQFP64; PackageDescription: 64-Pin Low Profile Quad Flat Package, 10 x 10 mm Body, 0.5 mm Pitch; Supplier 1: Digi-Key; Supplier Part Number 1: 497-6444-ND; Supplier 2: Farnell; Supplier Part Number 2: 1624138; Supplier 3: Newark; Supplier Part Number 3: 01P4101; Supplier 4: Newark; Supplier Part Number 4: 57P1231; Supplier 5: Mouser; Supplier Part Number 5: 511-STM32F103RET6; Core: ARM Cortex-M3; Packing: Tray; Mounting Technology: Surface Mount; PartNumber: STM32F103RET6; ComponentLink1Description: Manufacturer URL; ComponentLink1URL: http://www.st.com/web/en/home.html; ComponentLink2Description: Datasheet; ComponentLink2URL: http://www.st.com/st-web-ui/static/active/en/resource/technical/document/datasheet/CD00191185.pdf; ComponentLink3Description: Package Specification; ComponentLink3URL: http://www.st.com/st-web-ui/static/active/en/resource/technical/document/datasheet/DM00037051.pdf
U5 = LM4871: MF: Texas Instruments; Price: None; SnapEDA_Link: https://www.snapeda.com/parts/LM4871/Texas%20Instruments/view-part/?ref=snap; Availability: Unavailable; MP: LM4871; Package: SOIC-8 Texas Instruments; Value: *
U6 = TPS61040DBVR: 28-V, 400-mA Switch Boost Converter in SOT-23 for LCD and White LED Applications 5-SOT-23 -40 to 85; MF: Texas Instruments; Price: None; MP: TPS61040DBVR; Package: SOT-23-5 Texas Instruments; SnapEDA_Link: https://www.snapeda.com/parts/TPS61040DBVR/Texas%20Instruments/view-part/?ref=snap; Availability: Unavailable; Value: *
UP1-UP3 = AMS1117-x.x: x.x Volt, 800mA Low-Dropout Linear Regulator, 4-pin SOT-223; Designer: Ali Hafizi; Data: 16-12-2016
X1 = XTAL: XTAL Crystal; Company: E.P.I.L; Design Date: 11/04/2011; Value: 25 MHz